# Altium schematic sheet ResetRelays.SchDoc
size A4
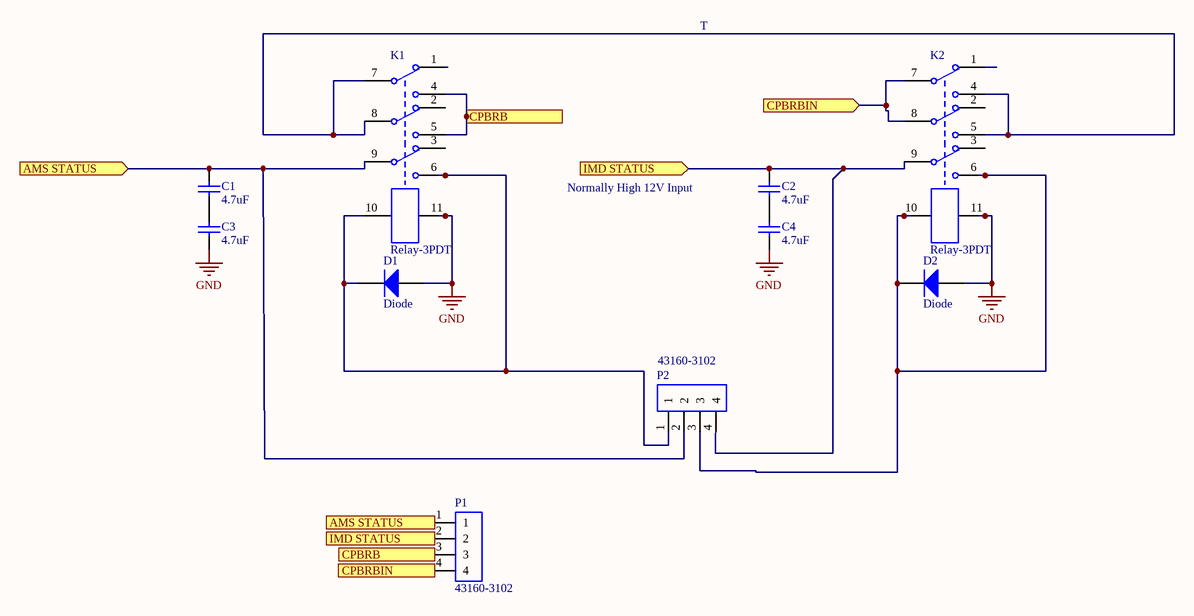
[diagram p0: ResetRelays.SchDoc]

## Parts
C1  4.7uF  [CAPC3216X170N]
C2  4.7uF  [CAPC3216X170N]
C3  4.7uF  [CAPC3216X170N]
C4  4.7uF  [CAPC3216X170N]
D1  Diode  [DO-220AA]
D2  Diode  [DO-220AA]
K1  Relay-3PDT  [55.13]
K2  Relay-3PDT  [55.13]
P1  43160-3102  [431603102]
P2  43160-3102  [431603102]

## Ports
AMS STATUS (in), CPBRB (out), CPBRBIN (in), IMD STATUS (in)

## Nets
GND: C3.1 C4.1 D1.1(A) D2.1(A) K1.11 K2.11
AMS STATUS: C1.2 K1.9 P1.1 P2.2 ; port AMS STATUS
CPBRB: K1.4 K1.5 P1.3 ; port CPBRB
CPBRBIN: K2.7 K2.8 P1.4 ; port CPBRBIN
IMD STATUS: C2.2 K2.9 P1.2 P2.4 ; port IMD STATUS
NetC1_1: C1.1 C3.2
NetC2_1: C2.1 C4.2
NetD1_2: D1.2(K) K1.6 K1.10 P2.1
NetD2_2: D2.2(K) K2.6 K2.10 P2.3
NetK1_7: K1.7 K1.8 K2.4 K2.5

Not connected (* = marked no-connect by the designer): K1 1 2 3; K2 1 2 3

## Notes on the sheet
- T
- Normally High 12V Input

## Library data of the parts
C1-C4 = Cap Semi: Capacitor (Semiconductor SIM Model); Manufacturer: Murata; Manufacturer Part Number: GRM31MR71H105KA88L; Material: Ceramic; Tolerance: 10%; Voltage Rating: 50V; Capacitance: 1uF; Dielectric: X7R; Published: 8-Jun-2000; LatestRevisionDate: 29-May-2009; LatestRevisionNote: IPC-7351 Footprint Added.; PackageReference: C1206; Publisher: Altium Limited; PackageDescription: Chip Capacitor; Value: 4.7uF; Supplier 1: Digi-Key; Stock 1: 0; Mount: Surface Mount; Case/Package: 1206; Number of Pins: 2; Case Code (Metric): 3216; Case Code (Imperial): 1206; Min Operating Temperature: -55°C; Max Operating Temperature: 125°C; Package Quantity: 1; Packaging: Tape and Reel; Voltage Rating (DC): 50V; Termination: SMD/SMT; Voltage: 50V; Length: 3.2mm; Height: 1.15mm; Width: 0.063inch; Thickness: 0.049inch; Depth: 1.6mm; REACH SVHC: No SVHC; Lead Free: Lead Free; ComponentLink1URL: https://datasheet.ciiva.com/16379/product-16379616.pdf; ComponentLink1Description: https://datasheet.ciiva.com/16379/product-16379616.pdf; ComponentLink2URL: https://datasheet.ciiva.com/14116/nmgrm-data-en-14116709.pdf; ComponentLink2Description: https://datasheet.ciiva.com/14116/nmgrm-data-en-14116709.pdf; ComponentLink3URL: https://datasheet.ciiva.com/22703/608985-22703384.pdf; ComponentLink3Description: https://datasheet.ciiva.com/22703/608985-22703384.pdf; ComponentLink4URL: https://datasheet.ciiva.com/3777/42grm31mr71h105ka8823-3777081.pdf; ComponentLink4Description: https://datasheet.ciiva.com/3777/42grm31mr71h105ka8823-3777081.pdf; ComponentLink5URL: https://datasheet.ciiva.com/6270/partnumbering-e-01-6270398.pdf; ComponentLink5Description: https://datasheet.ciiva.com/6270/partnumbering-e-01-6270398.pdf; ComponentLink6URL: https://datasheet.ciiva.com/6270/partnumbering-e-01-6270399.pdf; ComponentLink6Description: https://datasheet.ciiva.com/6270/partnumbering-e-01-6270399.pdf; ComponentLink7URL: https://datasheet.ciiva.com/29199/455056-da-01-en-vs-kondensator-1206-29199449.pdf; ComponentLink7Description: https://datasheet.ciiva.com/29199/455056-da-01-en-vs-kondensator-1206-29199449.pdf; ComponentLink8URL: https://datasheet.ciiva.com/29202/450923-da-01-de-vs-chip-kond-1206-1-0-uf-10pr-50-0v-x7r-29202718.pdf; ComponentLink8Description: https://datasheet.ciiva.com/29202/450923-da-01-de-vs-chip-kond-1206-1-0-uf-10pr-50-0v-x7r-29202718.pdf; Supplier 2: Digi-Key; Supplier Part Number: 1276-1055-1-ND
D1 D2 = Diode: Default Diode; Published: 8-Jun-2000; LatestRevisionDate: 17-Jul-2002; LatestRevisionNote: Re-released for DXP Platform.; PackageVersion: Sep-1996; PackageReference: SMC; Publisher: Altium Limited; PackageDescription: DO-214-AB/SMC; 2 C-Bend Leads; Body 7.9 x 5.9 mm, inc. leads (LxW); Code_JEDEC: DO-214-AB; Supplier 1: Digi-Key; Supplier 2: Digi-Key; Supplier Part Number: SS1P3L-M3/84AGICT-ND
P1 P2 = 0431600104: 4pin blade header molex; Allied_Number: 70372885; Geometry.Height: 11mm; Manufacturer_Name: Molex; Manufacturer_Part_Number: 43160-3102; RS Part Number: 3639982P; RS Price/Stock: http://uk.rs-online.com/web/p/products/3639982P; Allied Price/Stock: https://www.alliedelec.com/molex-incorporated-43160-3102/70372885/; Arrow Part Number: 43160-3102; Arrow Price/Stock: http://uk.rs-online.com/web/p/products/3639982P; Datasheet Link: https://www.molex.com/pdm_docs/sd/431603102_sd.pdf
K1 K2 = Relay-3PDT: ComponentLink1Description: Manufacturer Link; ComponentLink2Description: Datasheet